# Altium schematic sheet Power_Supply_AC_to_DC.SchDoc
size A; SheetNumber: 7; SheetTotal: 8
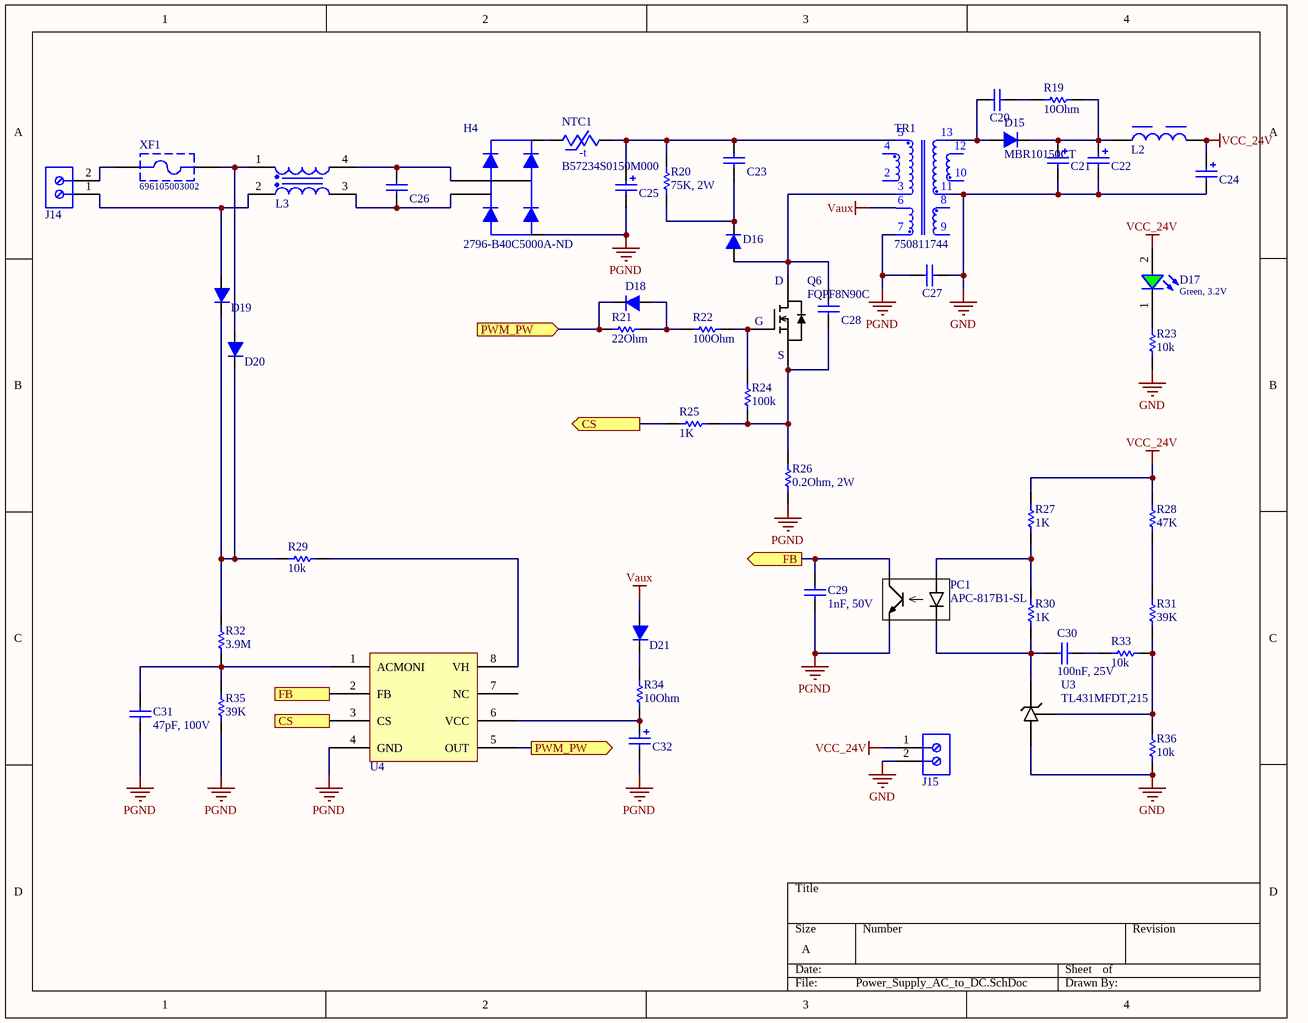
[diagram p0: Power_Supply_AC_to_DC.SchDoc]

## Parts
C20  1nF  [WCAP-CSMH_0805_L2W1.25H0.8_Reflow]  (value not drawn)
C21  1200uF  [WCAP-ATG8_D16H31.5]  (value not drawn)
C22  1200uF  [WCAP-ATG8_D16H31.5]  (value not drawn)
C23  4.7nF  [WCAP-CSMH_1206_L3.2W1.6H1.25]  (value not drawn)
C24  100uF  [WCAP-ATG8_D8H11.5]  (value not drawn)
C25  220uF  [WCAP-AI3H_D22H50]  (value not drawn)
C26  2.2uF  [WCAP-FTX2_L26W15H25]  (value not drawn)
C27  2.2nF  [WCAP-CSSA_2211_L5.7W2.8H2.5]  (value not drawn)
C28  22pF  [WCAP-CSMH_1210_L3.2W2.5H0.95]  (value not drawn)
C29  1nF, 50V  [WCAP-CSGP_0805_H=0.8mm_Reflow]
C30  100nF, 25V  [WCAP-CSGP_0805_H=0.8mm_Reflow]
C31  47pF, 100V  [WCAP-CSGP_0805_H=0.6mm_Reflow]
C32  10uF  [WCAP-ATG8_D5H11]  (value not drawn)
D15  MBR10150CT  [MBR10150CT]
D16  RS1M-13-F  [SMA]  (value not drawn)
D17  Green, 3.2V  [WL-SMCW_0603_H=0.7mm]
D18  CDBA360-HF  [SMA]  (value not drawn)
D19  RFU02VSM8STR  [Flat Lead]  (value not drawn)
D20  RFU02VSM8STR  [Flat Lead]  (value not drawn)
D21  RS1M-13-F  [SMA]  (value not drawn)
H4  2796-B40C5000A-ND  [GBJ-4]
J14  691137710002  [691137710002]  (value not drawn)
J15  691137710002  [691137710002]  (value not drawn)
L2  10µH, 7A  [WE-LHMI_1040]  (value not drawn)
L3  13mH  [WE-FC_UT20V]  (value not drawn)
NTC1  B57234S0150M000  [NTC]
PC1  APC-817B1-SL  [APC-817B1-SL]
Q6  FQPF8N90C  [FQPF8N90C]
R19  value 10Ohm  [RES-SM-2512]  (hidden comment: RK73H3ATTE10R0D)
R20  value 75K, 2W  [RES-SM-2512]  (hidden comment: 352175KFT)
R21  value 22Ohm  [RES-SM-0805]  (hidden comment: RK73H2ATTD22R0F)
R22  value 100Ohm  [RES-SM-0805]  (hidden comment: RK73B2ATTD101J)
R23  value 10k  [RES-SM-0805]  (hidden comment: RK73H2ATTD1002F)
R24  value 100k  [RES-SM-0805]  (hidden comment: RK73H2ATTD1003F)
R25  value 1K  [RES-SM-0805]  (hidden comment: RK73B2ATTD102J)
R26  value 0.2Ohm, 2W  [RES-SM-2010]  (hidden comment: WFMB2010R2000FEA)
R27  value 1K  [RES-SM-0805]  (hidden comment: RK73B2ATTD102J)
R28  value 47K  [RES-SM-0805]  (hidden comment: RK73B2ATTD473J)
R29  value 10k  [RES-SM-0805]  (hidden comment: RK73H2ATTD1002F)
R30  value 1K  [RES-SM-0805]  (hidden comment: RK73B2ATTD102J)
R31  value 39K  [RES-SM-0805]  (hidden comment: RK73B2ATTD393J)
R32  value 3.9M  [RES-SM-0805]  (hidden comment: RK73B2ATTD395J)
R33  value 10k  [RES-SM-0805]  (hidden comment: RK73H2ATTD1002F)
R34  value 10Ohm  [RES-SM-0805]  (hidden comment: RK73H2ATTD10R0F)
R35  value 39K  [RES-SM-0805]  (hidden comment: RK73B2ATTD393J)
R36  value 10k  [RES-SM-0805]  (hidden comment: RK73H2ATTD1002F)
TR1  750811744  [750811744]
U3  TL431MFDT,215  [TO-236AB]
U4  BM1P061FJ-E2  [SOP-J8]  (value not drawn)
XF1  696105003002  [696105003002]

## Ports
CS (in), CS (out), FB (in), FB (out), PWM_PW (in), PWM_PW (out)

## Nets
GND: C21.2(N) C22.2(N) C24.2(N) C27.1 J15.2 R23.2 R36.2 TR1.11 U3.3
PGND: C25.2(N) C27.2 C29.1 C31.1 C32.2(N) H4.4(-) PC1.3 R26.1 R35.1 TR1.7 U4.4(GND)
Vaux: D21.1(A) TR1.6
VCC_24V: C24.1(P) D17.2(A) J15.1 L2.2 R27.1 R28.2
CS: R25.2 U4.3(CS) ; port CS
FB: C29.2 PC1.4 U4.2(FB) ; port FB
PWM_PW: D18.2(K) R21.1 U4.5(OUT) ; port PWM_PW
NetC20_1: C20.1 D15.1(A) TR1.13
NetC20_2: C20.2 R19.1
NetC21_1: C21.1(P) C22.1(P) D15.2(K) L2.1 R19.2
NetC23_1: C23.1 D16.2(K) R20.1
NetC23_2: C23.2 C25.1(P) NTC1.2 R20.2 TR1.5
NetC26_1: C26.1 H4.3 L3.3
NetC26_2: C26.2 H4.2 L3.4
NetC28_1: C28.1 Q6.3(S) R24.1 R25.1 R26.2
NetC28_2: C28.2 D16.1(A) Q6.2(D) TR1.3
NetC30_1: C30.1 PC1.2 R30.2 U3.1
NetC30_2: C30.2 R33.1
NetC31_2: C31.2 R32.1 R35.2 U4.1(ACMONI)
NetC32_1: C32.1(P) R34.1 U4.6(VCC)
NetD17_1: D17.1(K) R23.1
NetD18_1: D18.1(A) R21.2 R22.1
NetD19_1: D19.1(A) J14.1 L3.2
NetD19_2: D19.2(K) D20.2(K) R29.2 R32.2
NetD20_1: D20.1(A) L3.1 XF1.2
NetD21_2: D21.2(K) R34.2
NetH4_1: H4.1(+) NTC1.1
NetJ14_2: J14.2 XF1.1
NetPC1_1: PC1.1 R27.2 R30.1
NetQ6_1: Q6.1(G) R22.2 R24.2
NetR28_1: R28.1 R31.2
NetR29_1: R29.1 U4.8(VH)
NetR31_1: R31.1 R33.2 R36.1 U3.2

Not connected (* = marked no-connect by the designer): TR1 2 4 8 9 10 12; U4 7(NC)

## Notes on the sheet
- (in symbol NTC) -t

## Library data of the parts
C20 = 885342207013: WCAP-CSMH Multilayer Ceramic Chip Capacitor, Mid and High Voltage, size 0805, X7R Class II, 1nF, 500; Manufacturer: Wurth Elektronik; Case/Size Code: 0805; Capacitance Tolerance: 10%; Dissipation Factor: 2.5%; Insulation Resistance: 10GΩ; Rated Voltage (DC): 500V; Technical Reference: X7R0805102K500DFCT10000; No. Pad (SMD): 2; No. Pad (THT): 0; ComponentLink1Description: Website Link; ComponentLink1URL: https://www.we-online.com/redexpert/article/885342207013?ad; ComponentLink2Description: Datasheet Link; ComponentLink2URL: https://www.we-online.com/redexpert/spec/885342207013?ad; Manufacturer Part Number: 885342207013; Category: Multilayer Ceramic Chip Capacitors; Match Code: WCAP-CSMH; Mount: Surface Mount; Operating Temperature Max: 125°C; Operating Temperature Min: -55°C; Packaging: Tape and Reel; Length: 2mm; Width: 1.25mm; Height: 0.8mm; Capacitance: 1nF; Ceramic Type: X7R Class II; Unit Price (Digikey): 0.1
C21 C22 = 860010780025: WCAP-ATG8 Aluminum Electrolytic Capacitor, Radial THT, D16xH31.5mm, 1200uF, 63V; Manufacturer: Wurth Elektronik; Capacitance Tolerance: +/-20%; Dissipation Factor: 9%; Endurance: 2000h; Leakage Current: 756uA; Ripple Current: 1837mA; Technical Reference: ATBK315122M063DSPADB000; No. Pad (SMD): 0; No. Pad (THT): 2; ComponentLink1Description: Manufacturer Link; ComponentLink1URL: https://www.we-online.com/redexpert/article/860010780025?ad; ComponentLink2Description: Datasheet; ComponentLink2URL: https://www.we-online.com/redexpert/spec/860010780025?ad; Category: Aluminum Electrolytic Capacitors; Match Code: WCAP-ATG8; Manufacturer Part Number: 860010780025; Mount: Through Hole; Operating Temperature Max: 85°C; Operating Temperature Min: -40°C; Packaging: Ammo Pack; Height: 31.5mm; Diameter: 16mm; Capacitance: 1200uF; Rated Voltage (DC): 63V; Unit Price (Digikey): 2.81
C23 = 885342208008: WCAP-CSMH Multilayer Ceramic Chip Capacitor, Mid and High Voltage, size 1206, X7R Class II, 4.7nF, 5; Manufacturer: Wurth Elektronik; Case/Size Code: 1206; Capacitance Tolerance: 10%; Dissipation Factor: 2.5%; Insulation Resistance: 10GΩ; Rated Voltage (DC): 500V; Technical Reference: X7R1206472K500DFCT10000; No. Pad (SMD): 2; No. Pad (THT): 0; ComponentLink1Description: Website Link; ComponentLink1URL: https://www.we-online.com/redexpert/article/885342208008?ad; ComponentLink2Description: Datasheet Link; ComponentLink2URL: https://www.we-online.com/redexpert/spec/885342208008?ad; Manufacturer Part Number: 885342208008; Category: Multilayer Ceramic Chip Capacitors; Match Code: WCAP-CSMH; Mount: Surface Mount; Operating Temperature Max: 125°C; Operating Temperature Min: -55°C; Packaging: Tape and Reel; Length: 3.2mm; Width: 1.6mm; Height: 1.25mm; Capacitance: 4.7nF; Ceramic Type: X7R Class II; Unit Price (Digikey): 0.14
C24 = 860010674014: WCAP-ATG8 Aluminum Electrolytic Capacitor, Radial THT, D8xH11.5mm, 100uF, 50V; Manufacturer: Wurth Elektronik; Capacitance Tolerance: +/-20%; Dissipation Factor: 10%; Endurance: 2000h; Leakage Current: 50uA; Ripple Current: 286mA; Technical Reference: ATBE115101M050DSPA7B000; No. Pad (SMD): 0; No. Pad (THT): 2; ComponentLink1Description: Manufacturer Link; ComponentLink1URL: https://www.we-online.com/redexpert/article/860010674014?ad; ComponentLink2Description: Datasheet; ComponentLink2URL: https://www.we-online.com/redexpert/spec/860010674014?ad; Category: Aluminum Electrolytic Capacitors; Match Code: WCAP-ATG8; Manufacturer Part Number: 860010674014; Mount: Through Hole; Operating Temperature Max: 85°C; Operating Temperature Min: -40°C; Packaging: Ammo Pack; Height: 11.5mm; Diameter: 8mm; Capacitance: 100uF; Rated Voltage (DC): 50V; Unit Price (Digikey): 0.28
C25 = 861141483007: WCAP-AI3H Aluminum Electrolytic Capacitor, Snap-In, D22xH50mm, 220uF, 450V; Manufacturer: Wurth Elektronik; Capacitance Tolerance: +/-20%; Dissipation Factor: 20%; Endurance: 3000h; Leakage Current: 943.93uA; Ripple Current: 1000mA; Technical Reference: ANJN500221M450DSIC3C000; No. Pad (SMD): 0; No. Pad (THT): 2; ComponentLink1Description: Manufacturer Link; ComponentLink1URL: https://www.we-online.com/redexpert/article/861141483007?ad; ComponentLink2Description: Datasheet; ComponentLink2URL: https://www.we-online.com/redexpert/spec/861141483007?ad; Category: Aluminum Electrolytic Capacitors; Match Code: WCAP-AI3H; Manufacturer Part Number: 861141483007; Mount: Through Hole; Operating Temperature Max: 105°C; Operating Temperature Min: -25°C; Packaging: Tray; Height: 50mm; Diameter: 22mm; Capacitance: 220uF; Rated Voltage (DC): 450V; Unit Price (Digikey): 9.35
C26 = 890324026034: WCAP-FTX2 Film Capacitor, THT, L26W15H25mm, 2.2uF, 275VAC; Manufacturer: Wurth Elektronik; Capacitance Tolerance: +/-10%; Dissipation Factor @1kHz: 0.1%; Dissipation Factor @10kHz: 0.7%; Insulation Resistance: 10000Ohm x F; Pitch: 22.5mm; Rate of Voltage Rise: 170V/us; Rated Voltage (AC): 275V; Technical Reference: MX2P225225K275ASPB46000; No. Pad (SMD): 0; No. Pad (THT): 2; ComponentLink1Description: Manufacturer Link; ComponentLink1URL: https://www.we-online.com/redexpert/article/890324026034?ad; ComponentLink2Description: Datasheet; ComponentLink2URL: https://www.we-online.com/redexpert/spec/890324026034?ad; Category: Film Capacitors; Match Code: WCAP-FTX2; Manufacturer Part Number: 890324026034; Mount: Through Hole; Operating Temperature Max: 105°C; Operating Temperature Min: -40°C; Packaging: Carton; Length: 26mm; Width: 15mm; Height: 25mm; Capacitance: 2.2uF; Unit Price (Digikey): 3.2
C27 = 8853522130151: WCAP-CSSA Multilayer Ceramic Chip Safety Capacitor, 2211, X7R Class II, X1/Y2, 2.2nF, 250VAC; Manufacturer: Wurth Elektronik; Case/Size Code: 2211; Capacitance Tolerance: +/-10%; Dissipation Factor: 2.5%; Impulse Voltage: 5000VDC; Insulation Resistance: 10GOhm; Rated Voltage (AC): 250V; Technical Reference: X7R2211222KE00IFCT1B000; No. Pad (SMD): 2; No. Pad (THT): 0; ComponentLink1Description: Manufacturer Link; ComponentLink1URL: https://www.we-online.com/redexpert/article/8853522130151?ad; ComponentLink2Description: Datasheet; ComponentLink2URL: https://www.we-online.com/redexpert/spec/8853522130151?ad; Category: Multilayer Ceramic Chip Capacitors; Match Code: WCAP-CSSA; Manufacturer Part Number: 8853522130151; Mount: Surface Mount; Operating Temperature Max: 125°C; Operating Temperature Min: -55°C; Packaging: Tape and Reel; Length: 5.7mm; Width: 2.8mm; Height: 2.5mm; Capacitance: 2.2nF; Ceramic Type: X7R Class II; Safety Class: X1/Y2; Unit Price (Digikey): 3.04
C28 = 885342009002: WCAP-CSMH Multilayer Ceramic Chip Capacitor, Mid and High Voltage, size 1210, NP0 Class I, 22pF, 100; Manufacturer: Wurth Elektronik; Case/Size Code: 1210; Capacitance Tolerance: 5%; Insulation Resistance: 10GΩ; Q Factor: 840; Rated Voltage (DC): 1000V; Technical Reference: NP01210220JA00DFCT10000; No. Pad (SMD): 2; No. Pad (THT): 0; ComponentLink1Description: Website Link; ComponentLink1URL: https://www.we-online.com/redexpert/article/885342009002?ad; ComponentLink2Description: Datasheet Link; ComponentLink2URL: https://www.we-online.com/redexpert/spec/885342009002?ad; Manufacturer Part Number: 885342009002; Category: Multilayer Ceramic Chip Capacitors; Match Code: WCAP-CSMH; Mount: Surface Mount; Operating Temperature Max: 125°C; Operating Temperature Min: -55°C; Packaging: Tape and Reel; Length: 3.2mm; Width: 2.5mm; Height: 0.95mm; Capacitance: 22pF; Ceramic Type: NP0 Class I; Unit Price (Digikey): 0.85
C29 = 885012007063: WCAP-CSGP Multilayer Ceramic Chip Capacitor, General Purpose, size 0805, NP0, 1nF, 50V; Manufacturer: Wurth Elektronik; Rated Voltage: 50VDC; Isolation Resistance: >=10GOhm; Capacitance Tolerance: +/-5%; Dissipation Factor: Q>=1000; Technical Reference: NP00805102J050DFCT10000; No. Pad (SMD): 2; No. Pad (THT): 0; ComponentLink1Description: Manufacturer; ComponentLink1URL: http://www.we-online.de; ComponentLink2Description: Datasheet; ComponentLink2URL: https://www.we-online.com/catalog/datasheet/885012007063.pdf; Operating Temperature: -55 to +125degC; Packaging: Tape and Reel; Manufacturer Part Number: 885012007063; Published Date: May 2020; Ceramic Type: NP0; Height: 0.8mm; Mounting Technology: SMT; Size: 0805; Capacitance: 1nF; Unit Price (Digikey): 0.1
C30 = 885012207072: WCAP-CSGP Multilayer Ceramic Chip Capacitor, General Purpose, size 0805, X7R, 100nF, 25V; Manufacturer: Wurth Elektronik; Rated Voltage: 25VDC; Isolation Resistance: >=5GOhm; Capacitance Tolerance: +/-10%; Technical Reference: X7R0805104K025DFCT10000; No. Pad (SMD): 2; No. Pad (THT): 0; ComponentLink1Description: Manufacturer; ComponentLink1URL: http://www.we-online.de; ComponentLink2Description: Datasheet; ComponentLink2URL: https://www.we-online.com/catalog/datasheet/885012207072.pdf; Operating Temperature: -55 to +125degC; Packaging: Tape and Reel; Manufacturer Part Number: 885012207072; Published Date: May 2020; Ceramic Type: X7R; Dissipation Factor: =<3.5%; Height: 0.8mm; Mounting Technology: SMT; Size: 0805; Capacitance: 100nF; Unit Price (Digikey): 0.1
C31 = 885012007080: WCAP-CSGP Multilayer Ceramic Chip Capacitor, General Purpose, size 0805, NP0, 47pF, 100V; Manufacturer: Wurth Elektronik; Rated Voltage: 100VDC; Isolation Resistance: >=10GOhm; Capacitance Tolerance: +/-5%; Dissipation Factor: Q>=1000; Technical Reference: NP00805470J100DFCT10000; No. Pad (SMD): 2; No. Pad (THT): 0; ComponentLink1Description: Manufacturer; ComponentLink1URL: http://www.we-online.de; ComponentLink2Description: Datasheet; ComponentLink2URL: https://www.we-online.com/catalog/datasheet/885012007080.pdf; Operating Temperature: -55 to +125degC; Packaging: Tape and Reel; Manufacturer Part Number: 885012007080; Published Date: May 2020; Ceramic Type: NP0; Height: 0.6mm; Mounting Technology: SMT; Size: 0805; Capacitance: 47pF; Unit Price (Digikey): 0.1
C32 = 860010672009: WCAP-ATG8 Aluminum Electrolytic Capacitor, Radial THT, D5xH11mm, 10uF, 50V; Manufacturer: Wurth Elektronik; Capacitance Tolerance: +/-20%; Dissipation Factor: 10%; Endurance: 2000h; Leakage Current: 5uA; Ripple Current: 72mA; Technical Reference: ATBC110100M050DSPA3B000; No. Pad (SMD): 0; No. Pad (THT): 2; ComponentLink1Description: Manufacturer Link; ComponentLink1URL: https://www.we-online.com/redexpert/article/860010672009?ad; ComponentLink2Description: Datasheet; ComponentLink2URL: https://www.we-online.com/redexpert/spec/860010672009?ad; Category: Aluminum Electrolytic Capacitors; Match Code: WCAP-ATG8; Manufacturer Part Number: 860010672009; Mount: Through Hole; Operating Temperature Max: 85°C; Operating Temperature Min: -40°C; Packaging: Ammo Pack; Height: 11mm; Diameter: 5mm; Capacitance: 10uF; Rated Voltage (DC): 50V; Unit Price (Digikey): 0.12
D15 = Diode: DIODE ARRAY SCHOTTKY 150V TO220; Mfr: SMC Diode Solutions; Diode Configuration: 1 Pair Common Cathode; Current - Average Rectified (Io) (per Diode): 5A; Voltage - Forward (Vf) (Max) @ If: 930 mV @ 5 A; Speed: Fast Recovery =< 500ns, > 200mA (Io); Current - Reverse Leakage @ Vr: 1 mA @ 150 V; No. Pad (SMD): 0; No. Pad (THT): 3; Category: Discrete Semiconductor Products; Diode Type: Schottky; Voltage - DC Reverse (Vr) (Max): 150 V; Operating Temperature - Junction: -55°C ~ 150°C; Mounting Type: Through Hole; Package / Case: TO-220-3; Supplier Device Package: TO-220AB; Base Product Number: MBR10150; Unit Price (Digikey): 0.74
D16 D21 = Diode: DIODE GEN PURP 1KV 1A SMA; Mfr: Diodes Incorporated; Diode Type: Standard; Voltage - DC Reverse (Vr) (Max): 1000V; Voltage - Forward (Vf) (Max) @ If: 1.3 V @ 1 A; Speed: Fast Recovery =< 500ns, > 200mA (Io); Reverse Recovery Time (trr): 500 ns; Current - Reverse Leakage @ Vr: 5 µA @ 1000 V; Capacitance @ Vr, F: 15pF @ 4V, 1MHz; Base Product Number: RS1M; No. Pad (SMD): 2; No. Pad (THT): 0; Category: Discrete Semiconductor Products; Current - Average Rectified (Io): 1A; Mounting Type: Surface Mount; Package / Case: DO-214AC, SMA; ComponentLink1Description: Digikey; ComponentLink1URL: https://www.digikey.com/en/products/detail/diodes-incorporated/RS1M-13-F/775742?s=N4IgTCBcDaIEoGUCMBZAtEgzGgYiAugL5A; Unit Price (Digikey): 0.5
D17 = 150060GS75000: WL-SMCW SMT Mono-color Chip LED Waterclear, size 0603, Green, 3.2V, 140deg; Chip Technology: InGaN; Dominant Wavelength typ.: 525nm; Luminous Intensity typ.: 430mcd; Peak Wavelength typ.: 515nm; No. Pad (SMD): 2; No. Pad (THT): 0; Viewing Angle: 140deg; ComponentLink1Description: Manufacturer; ComponentLink1URL: http://www.we-online.de; ComponentLink2URL: https://www.we-online.com/catalog/datasheet/150060GS75000.pdf; ComponentLink2Description: Datasheet; Forward Voltage typ.: 3.2V; Emitting Color: Green; Mounting Technology: SMT; Operating Temperature: -40 to +85degC; Published Date: December 2019; Part Number: 150060GS75000; Packaging: Tape and Reel; Size: 0603; Publisher: Wurth Elektronik; Unit Price (Digikey): 0.15
D18 = Diode: DIODE SCHOTTKY 60V 3A DO214AC; Mfr: Comchip Technology; Voltage - Forward (Vf) (Max) @ If: 700 mV @ 3 A; Speed: Fast Recovery =< 500ns, > 200mA (Io); Current - Reverse Leakage @ Vr: 500 µA @ 60 V; Capacitance @ Vr, F: 250pF @ 4V, 1MHz; No. Pad (SMD): 2; No. Pad (THT): 0; Category: Discrete Semiconductor Products; Diode Type: Schottky; ComponentLink1Description: Digikey; ComponentLink1URL: https://www.digikey.com/en/products/detail/comchip-technology/CDBA360-HF/5226173; Voltage - DC Reverse (Vr) (Max): 60 V; Current - Average Rectified (Io): 3A; Package / Case: DO-214AC, SMA; Operating Temperature - Junction: -50°C ~ 150°C; Base Product Number: CDBA360; Unit Price (Digikey): 0.39
D19 D20 = Diode: DIODE GP 800V 200MA TUMD2SM; Mfr: Rohm Semiconductor; Diode Type: Standard; Voltage - Forward (Vf) (Max) @ If: 3 V @ 200 mA; Speed: Small Signal =< 200mA (Io), Any Speed; Reverse Recovery Time (trr): 25 ns; Current - Reverse Leakage @ Vr: 10 µA @ 800 V; Capacitance @ Vr, F: 4pF @ 0V, 1MHz; Base Product Number: RFU02; No. Pad (SMD): 2; No. Pad (THT): 0; Category: Discrete Semiconductor Products; Voltage - DC Reverse (Vr) (Max): 800 V; Current - Average Rectified (Io): 200mA; ComponentLink1Description: Digikey; ComponentLink1URL: https://www.digikey.com/en/products/detail/rohm-semiconductor/RFU02VSM8STR/5113962; Mounting Type: Surface Mount; Package / Case: 2-SMD, Flat Lead; Operating Temperature - Junction: 150°C (Max); Unit Price (Digikey): 0.44
H4 = H Bridge: Bridge Rectifier Single Phase Standard 80 V Through Hole 4-SIP; Voltage - Peak Reverse (Max): 80 V; Current - Average Rectified (Io): 4 A; Voltage - Forward (Vf) (Max) @ If: 1 V @ 5 A; Current - Reverse Leakage @ Vr: 5 µA @ 80 V; No. Pad (SMD): 0; No. Pad (THT): 4; Diode Type: Single Phase; Technology: Standard; Operating Temperature: -50°C ~ 150°C (TJ); Mounting Type: Through Hole; Package / Case: 4-SIP; Supplier Device Package: 4-SIP; ComponentLink1Description: Digikey; ComponentLink1URL: https://www.digikey.com/en/products/detail/diotec-semiconductor/B40C5000A/13155422; Unit Price (Digikey): 1.36
J14 J15 = 691137710002: WR-TBL Series 1377 Horizontal Entry, Through Hole, pitch 5mm, 2p; Manufacturer: Wurth Elektronik; Pin Number: 2; Rated Current: 16A; Working Voltage: 300V; PCB/Cable/Panel: PCB; Modularity: No; No. Pad (SMD): 0; ComponentLink1Description: Manufacturer Link; ComponentLink1URL: https://www.we-online.com/redexpert/article/691137710002?ad; ComponentLink2Description: Datasheet; ComponentLink2URL: https://www.we-online.com/redexpert/spec/691137710002?ad; Category: Terminal Blocks; Match Code: WR-TBL; Manufacturer Part Number: 691137710002; Mount: Through Hole; Operating Temperature Max: 120°C; Operating Temperature Min: -30°C; Packaging: Box; Pitch: 5mm; Orientation: Horizontal; Application: Pressure Clamp; No. Pad (THT): 2; Unit Price (Digikey): 0.41
L2 = 74437368100: WE-LHMI SMT Power Inductor, size 1040, 10µH, 7A, 30mΩ; Manufacturer: Wurth Elektronik; Case/Size Code: 1040; DC Resistance: 27mΩ; Saturation Current @10%: 7.9A; Saturation Current @30%: 16.8A; Self Resonant Frequency: 12MHz; No. Pad (SMD): 2; No. Pad (THT): 0; ComponentLink1Description: Website Link; ComponentLink1URL: https://www.we-online.com/redexpert/article/74437368100?ad; ComponentLink2Description: Datasheet Link; ComponentLink2URL: https://www.we-online.com/redexpert/spec/74437368100?ad; Manufacturer Part Number: 74437368100; Category: Shielded Power Inductors; Match Code: WE-LHMI; Mount: Surface Mount; Operating Temperature Max: 125°C; Operating Temperature Min: -40°C; Packaging: Tape and Reel; Length: 10mm; Width: 10mm; Height: 3.8mm; DC Resistance Max: 30mΩ; Inductance: 10µH; Performance Rated Current: 7A; Unit Price (Digikey): 2.57
L3 = 7448640415: WE-FC THT Common Mode Power Line Choke, UT20V, 13mH, 0.8A, 0.708Ω; Manufacturer: Wurth Elektronik; Insulation Test Voltage (AC): 2000V; Material: MnZn; Rated Voltage (AC): 250V; No. Pad (SMD): 0; No. Pad (THT): 4; ComponentLink1Description: Website Link; ComponentLink1URL: https://www.we-online.com/redexpert/article/7448640415?ad; ComponentLink2Description: Datasheet Link; ComponentLink2URL: https://www.we-online.com/redexpert/spec/7448640415?ad; Manufacturer Part Number: 7448640415; Category: Common Mode Chokes; Match Code: WE-FC; Mount: Through Hole; Operating Temperature Max: 125°C; Operating Temperature Min: -40°C; Packaging: Tray; Case/Size Code: UT20V; Length: 21.3mm; Width: 16.6mm; Height: 22.5mm; DC Resistance: 0.708Ω; Inductance: 13mH; Rated Current: 0.8A; Unit Price (Digikey): 2.07
NTC1 = NTC: THERMISTOR NTC 15OHM 3000K; Mfr: EPCOS - TDK Electronics; Product Status: Active; R @ 25°C: 15 Ohms; Tolerance: ±20%; Current - Steady State Max: 4 A; Approval Agency: UL; No. Pad (SMD): 0; No. Pad (THT): 2; Category: Circuit Protection; Series: S234; Package: Bulk; Diameter: 0.591" (15.00mm); Lead Spacing: 0.295" (7.50mm); ComponentLink1Description: New link; ComponentLink1URL: *; Unit Price (Digikey): 2.1
PC1 = Opto Isolator: DIP4, DC INPUT, PHOTO TRANSISTOR; Mfr: American Bright Optoelectronics Corporation; Number of Channels: 1; Voltage - Isolation: 5000Vrms; Current Transfer Ratio (Min): 130% @ 5mA; Current Transfer Ratio (Max): 260% @ 5mA; Rise / Fall Time (Typ): 3µs, 4µs; Voltage - Output (Max): 35V; Current - Output / Channel: 50mA; Voltage - Forward (Vf) (Typ): 1.24V; Current - DC Forward (If) (Max): 60 mA; Vce Saturation (Max): 200mV; No. Pad (SMD): 4; No. Pad (THT): 0; Category: Isolators; Series: APC-817; Input Type: DC; Output Type: Transistor; Operating Temperature: -55°C ~ 110°C; Package / Case: 4-SMD, Gull Wing; Base Product Number: APC-817; ComponentLink1Description: Digikey; ComponentLink1URL: https://www.digikey.com/en/products/detail/american-bright-optoelectronics-corporation/APC-817B1-SL/16273138?s=N4IgTCBcDaIIIAUDCAOAjAdgLQCE1YGUAZEAXQF8g; Unit Price (Digikey): 0.45
Q6 = Mosfet: MOSFET N-CH 900V 6.3A TO220F; Mfr: onsemi; FET Type: N-Channel; Current - Continuous Drain (Id) @ 25°C: 6.3A (Tc); Drive Voltage (Max Rds On, Min Rds On): 10V; Rds On (Max) @ Id, Vgs: 1.9Ohm @ 3.15A, 10V; Vgs(th) (Max) @ Id: 5V @ 250µA; Gate Charge (Qg) (Max) @ Vgs: 45 nC @ 10 V; Vgs (Max): ±30V; Input Capacitance (Ciss) (Max) @ Vds: 2080 pF @ 25 V; Power Dissipation (Max): 60W (Tc); Base Product Number: FQPF8; No. Pad (SMD): 0; No. Pad (THT): 3; Technology: MOSFET (Metal Oxide); Drain to Source Voltage (Vdss): 900 V; Operating Temperature: -55°C ~ 150°C (TJ); Mounting Type: Through Hole; Supplier Device Package: TO-220F-3; Package / Case: TO-220-3 Full Pack; ComponentLink1Description: New link; ComponentLink1URL: *; Unit Price (Digikey): 3.25
R19 = RESISTOR SMD: RES 10 OHM 0.5% 1W 2512; Mfr: KOA Speer Electronics, Inc.; Resistance: 10 Ohms; Temperature Coefficient: ±100ppm/°C; No. Pad (SMD): 2; No. Pad (THT): 0; Category: Resistors; Series: RK73H; Tolerance: ±0.5%; Power (Watts): 1W; Composition: Thick Film; Features: Automotive AEC-Q200, Moisture Resistant; Operating Temperature: -55°C ~ 155°C; Package / Case: 2512 (6432 Metric); Ratings: AEC-Q200; Size / Dimension: 0.248" L x 0.122" W (6.30mm x 3.10mm); Base Product Number: RK73H3A; ComponentLink1Description: Digikey; ComponentLink1URL: https://www.digikey.com/en/products/detail/koa-speer-electronics-inc/RK73H3ATTE10R0D/10431990; Unit Price (Digikey): 0.13
R20 = RESISTOR SMD: RES SMD 75K OHM 1% 2W 2512; Mfr: TE Connectivity Passive Product; Resistance: 75 kOhms; Temperature Coefficient: ±100ppm/°C; No. Pad (SMD): 2; No. Pad (THT): 0; Category: Resistors; Series: 3521, CGS; Tolerance: ±1%; Power (Watts): 2W; Composition: Thick Film; Features: Automotive AEC-Q200; Operating Temperature: -55°C ~ 155°C; Package / Case: 2512 (6432 Metric); Ratings: AEC-Q200; Size / Dimension: 0.248" L x 0.126" W (6.30mm x 3.20mm); Height - Seated (Max): 0.026" (0.65mm); ComponentLink1Description: Digikey; ComponentLink1URL: https://www.digikey.com/en/products/detail/te-connectivity-passive-product/352175KFT/4279980?s=N4IgTCBcDaIMwFYwEYDsCDSAxAKiAugL5A; Unit Price (Digikey): 0.59
R21 = RESISTOR SMD: RES 22 OHM 1% 1/4W 0805; Mfr: KOA Speer Electronics, Inc.; Resistance: 22 Ohms; Power (Watts): 0.25W, 1/4W; Temperature Coefficient: ±100ppm/°C; No. Pad (SMD): 2; No. Pad (THT): 0; Category: Resistors; Series: RK73H; Tolerance: ±1%; Composition: Thick Film; Features: Automotive AEC-Q200, Moisture Resistant; Operating Temperature: -55°C ~ 155°C; ComponentLink1Description: Digikey; ComponentLink1URL: https://www.digikey.com/en/products/detail/koa-speer-electronics-inc/RK73H2ATTD22R0F/10234130?s=N4IgTCBcDaIEoGkDsBmAEmAggFWwETDDgAYAxEAXQF8g; Package / Case: 0805 (2012 Metric); Ratings: AEC-Q200; Size / Dimension: 0.079" L x 0.049" W (2.00mm x 1.25mm); Base Product Number: RK73H2A; Unit Price (Digikey): 0.1
R22 = RESISTOR SMD: RES 100 OHM 5% 1/4W 0805; Mfr: KOA Speer Electronics, Inc.; Resistance: 100 Ohms; Power (Watts): 0.25W, 1/4W; Temperature Coefficient: ±200ppm/°C; No. Pad (SMD): 2; No. Pad (THT): 0; Category: Resistors; ComponentLink1Description: Digikey; ComponentLink1URL: https://www.digikey.com/en/products/detail/koa-speer-electronics-inc/RK73B2ATTD101J/10236510?s=N4IgTCBcDaIE4GsDsBmARmAhgF2wEwEYAGAgKxAF0BfIA; Series: RK73B; Tolerance: ±5%; Composition: Thick Film; Features: Automotive AEC-Q200; Operating Temperature: -55°C ~ 155°C; Package / Case: 0805 (2012 Metric); Size / Dimension: 0.079" L x 0.049" W (2.00mm x 1.25mm); Base Product Number: RK73B2A; Unit Price (Digikey): 0.1
R23 R29 R33 R36 = RESISTOR SMD: RES 10K OHM 1% 1/4W 0805; Mfr: KOA Speer Electronics, Inc.; Resistance: 10 kOhms; Power (Watts): 0.25W, 1/4W; Temperature Coefficient: ±100ppm/°C; No. Pad (SMD): 2; No. Pad (THT): 0; Category: Resistors; Series: RK73H; Tolerance: ±1%; Composition: Thick Film; Features: Automotive AEC-Q200, Moisture Resistant; Operating Temperature: -55°C ~ 155°C; Package / Case: 0805 (2012 Metric); Size / Dimension: 0.079" L x 0.049" W (2.00mm x 1.25mm); Base Product Number: RK73H2A; ComponentLink1Description: Digikey; ComponentLink1URL: https://www.digikey.com/en/products/detail/koa-speer-electronics-inc/RK73H2ATTD1002F/10234111; Unit Price (Digikey): 0.1
R24 = RESISTOR SMD: RES 100K OHM 1% 1/4W 0805; Mfr: KOA Speer Electronics, Inc.; Resistance: 100 kOhms; Power (Watts): 0.25W, 1/4W; Temperature Coefficient: ±100ppm/°C; No. Pad (SMD): 2; No. Pad (THT): 0; Series: RK73H; Tolerance: ±1%; Composition: Thick Film; Features: Automotive AEC-Q200, Moisture Resistant; Operating Temperature: -55°C ~ 155°C; Package / Case: 0805 (2012 Metric); Supplier Device Package: 0805; Ratings: AEC-Q200; Size / Dimension: 0.079" L x 0.049" W (2.00mm x 1.25mm); ComponentLink1Description: Digikey; ComponentLink1URL: https://www.digikey.com/en/products/detail/koa-speer-electronics-inc/RK73H2ATTD1003F/10234279; Height - Seated (Max): 0.024" (0.60mm); Number of Terminations: 2; Base Product Number: RK73H2A; Unit Price (Digikey): 0.1
R25 R27 R30 = RESISTOR SMD: RES 1K OHM 5% 1/4W 0805; Mfr: KOA Speer Electronics, Inc.; Resistance: 1 kOhms; Power (Watts): 0.25W, 1/4W; Temperature Coefficient: ±200ppm/°C; Base Product Number: RK73H2A; No. Pad (SMD): 2; No. Pad (THT): 0; Category: Resistors; Series: RK73H; Tolerance: ±5%; Composition: Thick Film; Features: Automotive AEC-Q200, Moisture Resistant; Operating Temperature: -55°C ~ 155°C; Package / Case: 0805 (2012 Metric); Size / Dimension: 0.079" L x 0.049" W (2.00mm x 1.25mm); ComponentLink1Description: Digikey; ComponentLink1URL: https://www.digikey.com/en/products/detail/koa-speer-electronics-inc/RK73H2ATTD1002F/10234111; Unit Price (Digikey): 0.1
R26 = RESISTOR SMD: RES 0.2 OHM 2.0 W 1% 2010 SMD; Mfr: Vishay Dale; Resistance: 200 mOhms; Power (Watts): 2W; Temperature Coefficient: ±50ppm/°C; No. Pad (SMD): 2; No. Pad (THT): 0; Category: Resistors; Series: WFM; Tolerance: ±1%; Composition: Metal Film; Features: Automotive AEC-Q200, Current Sense, Moisture Resistant; Operating Temperature: -65°C ~ 170°C; Package / Case: 2010 (5025 Metric); Size / Dimension: 0.200" L x 0.100" W (5.08mm x 2.54mm); ComponentLink1Description: Digikey; ComponentLink1URL: https://www.digikey.com/en/products/detail/vishay-dale/WFMB2010R2000FEA/9972271?s=N4IgTCBcDaIOoDECyAhMAGAjOgSh96CAogIIgC6AvkA; Unit Price (Digikey): 1.33
R28 = RESISTOR SMD: RES 47K OHM 5% 1/4W 0805; Mfr: KOA Speer Electronics, Inc.; Resistance: 47 kOhms; Power (Watts): 0.25W, 1/4W; Temperature Coefficient: ±400ppm/°C; No. Pad (SMD): 2; No. Pad (THT): 0; Category: Resistors; Series: RK73B; Tolerance: ±5%; Composition: Thick Film; Features: Automotive AEC-Q200; Operating Temperature: -55°C ~ 155°C; Package / Case: 0805 (2012 Metric); Ratings: AEC-Q200; Size / Dimension: 0.079" L x 0.049" W (2.00mm x 1.25mm); Height - Seated (Max): 0.024" (0.60mm); Base Product Number: RK73B2A; ComponentLink1Description: Digikey; ComponentLink1URL: https://www.digikey.com/en/products/detail/koa-speer-electronics-inc/RK73B2ATTD395J/10236524; Unit Price (Digikey): 0.1
R31 R35 = RESISTOR SMD: RES 39K OHM 5% 1/4W 0805; Mfr: KOA Speer Electronics, Inc.; Resistance: 39 KOhms; Power (Watts): 0.25W, 1/4W; Temperature Coefficient: ±400ppm/°C; No. Pad (SMD): 2; No. Pad (THT): 0; Category: Resistors; Series: RK73B; Tolerance: ±5%; Composition: Thick Film; Features: Automotive AEC-Q200; Operating Temperature: -55°C ~ 155°C; Package / Case: 0805 (2012 Metric); Ratings: AEC-Q200; Size / Dimension: 0.079" L x 0.049" W (2.00mm x 1.25mm); Height - Seated (Max): 0.024" (0.60mm); Base Product Number: RK73B2A; ComponentLink1Description: Digikey; ComponentLink1URL: https://www.digikey.com/en/products/detail/koa-speer-electronics-inc/RK73B2ATTD395J/10236524; Unit Price (Digikey): 0.1
R32 = RESISTOR SMD: RES 3.9M OHM 5% 1/4W 0805; Mfr: KOA Speer Electronics, Inc.; Resistance: 3.9 MOhms; Power (Watts): 0.25W, 1/4W; Temperature Coefficient: ±400ppm/°C; No. Pad (SMD): 2; No. Pad (THT): 0; Category: Resistors; Series: RK73B; Tolerance: ±5%; Composition: Thick Film; Features: Automotive AEC-Q200; Operating Temperature: -55°C ~ 155°C; Package / Case: 0805 (2012 Metric); Ratings: AEC-Q200; Size / Dimension: 0.079" L x 0.049" W (2.00mm x 1.25mm); Height - Seated (Max): 0.024" (0.60mm); Base Product Number: RK73B2A; ComponentLink1Description: Digikey; ComponentLink1URL: https://www.digikey.com/en/products/detail/koa-speer-electronics-inc/RK73B2ATTD395J/10236524; Unit Price (Digikey): 0.1
R34 = RESISTOR SMD: RES 10 OHM 1% 1/4W 0805; Mfr: KOA Speer Electronics, Inc.; Resistance: 10 Ohms; Power (Watts): 0.25W, 1/4W; Temperature Coefficient: ±100ppm/°C; No. Pad (SMD): 2; No. Pad (THT): 0; Category: Resistors; Series: RK73H; Tolerance: ±1%; Composition: Thick Film; Features: Automotive AEC-Q200, Moisture Resistant; Operating Temperature: -55°C ~ 155°C; Package / Case: 0805 (2012 Metric); Ratings: AEC-Q200; Size / Dimension: 0.079" L x 0.049" W (2.00mm x 1.25mm); Height - Seated (Max): 0.024" (0.60mm); Base Product Number: RK73H2A; ComponentLink1Description: Digikey; ComponentLink1URL: https://www.digikey.com/en/products/detail/koa-speer-electronics-inc/RK73H2ATTD10R0F/10234071; Unit Price (Digikey): 0.1
TR1 = 750811744: Flyback Converters For For DC/DC Converters SMPS Transformer 4000Vrms Isolation 80kHz Through Hole; Mfr: Würth Elektronik; Inductance @ Frequency: 450µH @ 10kHz; Voltage - Auxiliary: 14V @ 50mA; Voltage - Primary: 90 ~ 375V; No. Pad (SMD): 0; No. Pad (THT): 14; Height - Seated (Max): 1.200" (30.48mm); Size / Dimension: 1.559" L x 1.700" W (39.60mm x 43.18mm); Mounting Type: Through Hole; Frequency: 80kHz; Operating Temperature: -40°C ~ 125°C; Voltage - Isolation: 4000Vrms; Applications: Flyback Converters; Type: For DC/DC Converters; Package: Tray; Series: MID-OLON; Category: Transformers; Unit Price (Digikey): 9.17
U3 = IC Shunt: IC VREF SHUNT ADJ 2% TO236AB; Mfr: Nexperia USA Inc.; Output Type: Adjustable; Voltage - Output (Min/Fixed): 2.495V; Voltage - Output (Max): 36 V; Current - Output: 100 mA; Current - Cathode: 1 mA; Base Product Number: TL431; No. Pad (SMD): 3; No. Pad (THT): 0; Category: Integrated Circuits (ICs); Reference Type: Shunt; Tolerance: ±2%; Operating Temperature: -40°C ~ 125°C (TA); Mounting Type: Surface Mount; Package / Case: TO-236-3, SC-59, SOT-23-3; ComponentLink1Description: Digikey; ComponentLink1URL: https://www.digikey.com/en/products/detail/nexperia-usa-inc/TL431MFDT-215/2780405; Unit Price (Digikey): 0.41
U4 = IC PWM: IC OFFLINE SWITCH FLYBACK 8SOPJ; Mfr: Rohm Semiconductor; Output Isolation: Either; Internal Switch(s): No; Voltage - Start Up: 13.5 V; Voltage - Supply (Vcc/Vdd): 8.9V ~ 26V; Duty Cycle: 75%; Frequency - Switching: 65kHz; Fault Protection: Current Limiting, Over Voltage; No. Pad (SMD): 8; No. Pad (THT): 0; Category: Integrated Circuits (ICs); Topology: Flyback; Operating Temperature: -40°C ~ 85°C (TA); Package / Case: 8-SOIC (0.154", 3.90mm Width); Mounting Type: Surface Mount; Base Product Number: BM1P061; ComponentLink1Description: Digikey; ComponentLink1URL: https://www.digikey.com/en/products/detail/rohm-semiconductor/BM1P061FJ-E2/4625619?s=N4IgTCBcDaIEIFkCMAFADANiQMQFIgF0BfIA; Unit Price (Digikey): 1.59
XF1 = 696105003002: WR-FSH Fuseholder THT Blocks PCB Clip Cover; Manufacturer: Wurth Elektronik; Fuse Size: 5x20mm; No. Pad (SMD): 0; No. Pad (THT): 2; ComponentLink1Description: Manufacturer; ComponentLink1URL: http://www.we-online.de; ComponentLink2Description: Datasheet; ComponentLink2URL: https://www.we-online.com/catalog/datasheet/696105003002.pdf; Manufacturer Part Number: 696105003002; Published Date: March 2021; Operating Temperature: -30 to +120degC; Mounting Technology: THT; Packaging: Box; Unit Price (Digikey): 0.68